# EAGLE design Receiver Ckt (EAGLE 9.6.2)
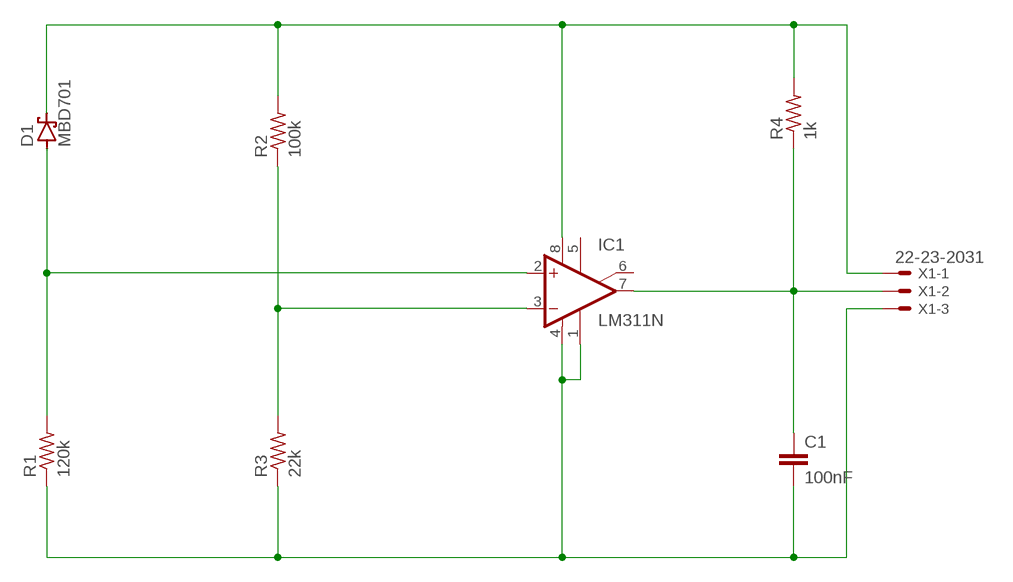
[diagram p0: schematic, sheet 1]

## Parts
C1  100nF  C-EUC0603  [C0603]
D1  MBD701  [TO92H]
IC1  LM311N  [DIL08]
R1  120k  R-US_R0603  [R0603]
R2  100k  R-US_R0603  [R0603]
R3  22k  R-US_R0603  [R0603]
R4  1k  R-US_R0603  [R0603]
X1  22-23-2031  [22-23-2031]

## Nets
N$1: D1.1(A) IC1.2(+IN) R1.2
N$2: C1.2 IC1.1(GND) IC1.4(V-) R1.1 R3.1 X1.3
N$3: D1.2(C) IC1.8(V+) R2.2 R4.2 X1.1
N$4: C1.1 IC1.7(OUT) R4.1 X1.2
N$6: IC1.3(-IN) R2.1 R3.2
Unconnected: IC1.5(ON) IC1.6(ON/STR)

## Library data of the parts
C1 = rcl:C-EU: CAPACITOR, European symbol; SPICEPREFIX: C
D1 = diode:MBD701: UHF DIODE
IC1 = linear:LM311: COMPARATOR
R1-R4 = rcl:R-US_: RESISTOR, American symbol; SPICEPREFIX: R
X1 = con-molex:22-23-2031: .100" (2.54mm) Center Header - 3 Pin; MF: MOLEX; MPN: 22-23-2031; OC_FARNELL: 1462950; OC_NEWARK: 30C0862

## Board
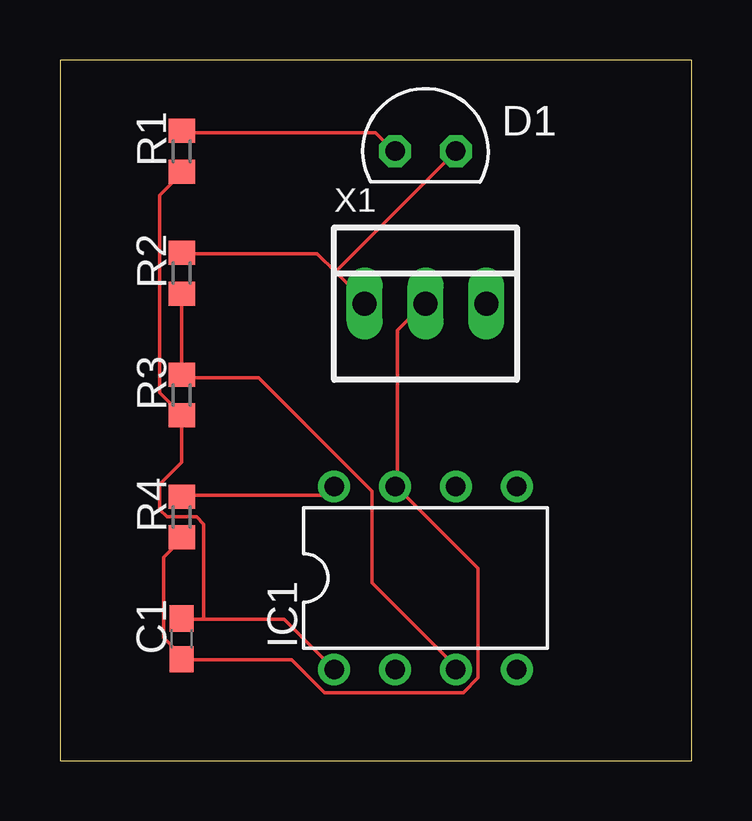
[diagram p1: board, top side]
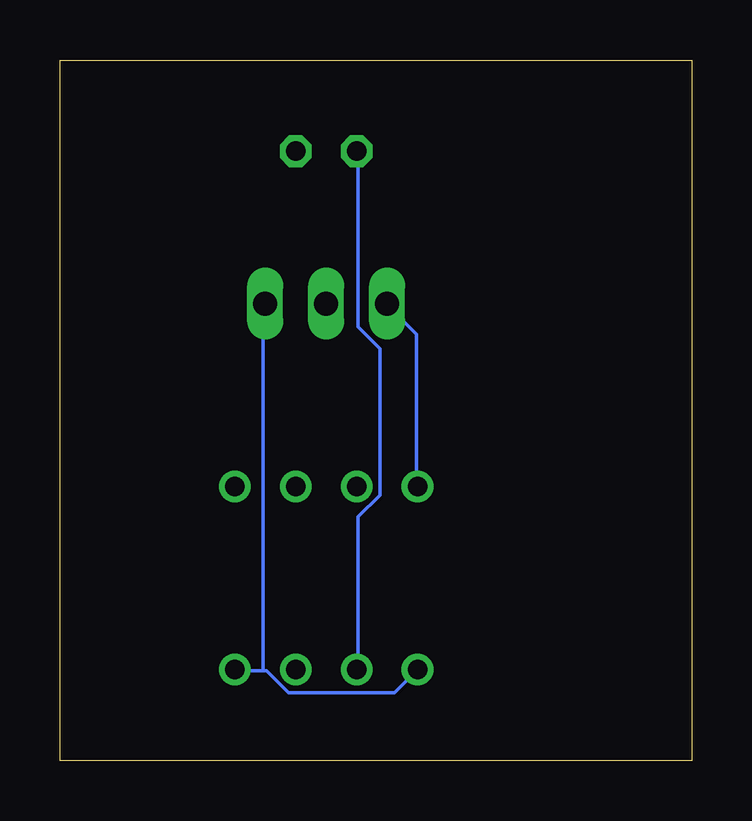
[diagram p2: board, bottom side, seen from below]

Size 26.34 x 29.2 mm. Coordinates in mm from the lower left corner, seen from the top.
Outline: 0,0 26.34,0 26.34,29.2 0,29.2 0,0
Copper layers (1*16): Top 0.035mm / dielectric 1.5mm / Bottom 0.035mm
Design rules "default": minimum track width 6mil, minimum drill 0.35mm, track to track 6mil, track to pad 6mil, pad to pad 6mil, via to via 6mil, smd to smd 6mil, copper to edge 40mil, drill to drill 6mil, minimum pad ring 10mil, minimum via ring 8mil, stop-mask expansion 4mil, vias tented up to drill 0mil, thermal gap 10mil

### Footprints (pad centres in the part's own frame; a part is rotated, then mirrored left to right if it is on the bottom)
C0603 = smd 1.1 x 1: 1 -0.85,0; 2 0.85,0
TO92H = drill 0.813 octagon: 1 -1.27,0; 2 1.27,0
DIL08 = drill 0.813 pad 1.27: 1 -3.81,-3.81; 2 -1.27,-3.81; 3 1.27,-3.81; 4 3.81,-3.81; 5 3.81,3.81; 6 1.27,3.81; 7 -1.27,3.81; 8 -3.81,3.81
R0603 = smd 1 x 1.1: 1 -0.85,0; 2 0.85,0
22-23-2031 = drill 1 long: 1 -2.54,0; 2 0,0; 3 2.54,0

### Placement (x,y rotation side)
C1  5.08,5.08 90 top
D1  15.24,25.4 0 top
IC1  15.24,7.62 0 top
R1  5.08,25.4 90 top
R2  5.08,20.32 90 top
R3  5.08,15.24 90 top
R4  5.08,10.16 90 top
X1  15.24,19.05 0 top

### Tracks (layer width: path | path; a pad name or v marks a point on that pad's centre or on a via)
N$1
  Top 0.152: R1.2 5.08,26.16 13.16,26.16 13.92,25.4 D1.1
  Bottom 0.152: IC1.2 13.92,3.91 13.92,10.16 13,11.07 13,17.17 13.92,18.09 13.92,25.4 D1.1
N$2
  Top 0.152: R1.1 5.08,24.49 4.17,23.57 4.17,15.34 5.08,14.43 R3.1 5.08,12.45 4.17,11.53 4.17,10.47 4.47,10.16 5.69,10.16 5.99,9.86 5.99,5.89 | 5.99,5.89 9.35,5.89 IC1.1 | 5.99,5.89 5.08,5.89 C1.2
  Bottom 0.152: 17.88,3.76 17.73,3.76 16.82,2.85 12.39,2.85 IC1.1 | 17.88,3.76 18.95,3.76 IC1.4 | 17.88,3.76 17.88,19 X1.3
N$3
  Top 0.152: R4.2 5.08,11.07 11.02,11.07 11.33,11.38 IC1.8 | 11.48,20.37 12.7,19.15 X1.1 | 11.48,20.37 10.72,21.13 5.08,21.13 R2.2 | 11.48,20.37 D1.2
  Bottom 0.152: IC1.8 11.48,11.53 11.48,17.78 12.7,19 X1.1
N$4
  Top 0.152: R4.1 5.08,9.25 4.32,8.48 4.32,5.13 5.08,4.37 C1.1 5.08,4.22 9.65,4.22 11.02,2.85 16.82,2.85 17.42,3.45 17.42,8.03 14.07,11.38 IC1.7 14.07,11.53 14.07,17.93 15.14,19 X1.2
N$6
  Top 0.152: R2.1 R3.2 5.08,15.95 8.28,15.95 13,11.23 13,7.42 16.51,3.91 IC1.3